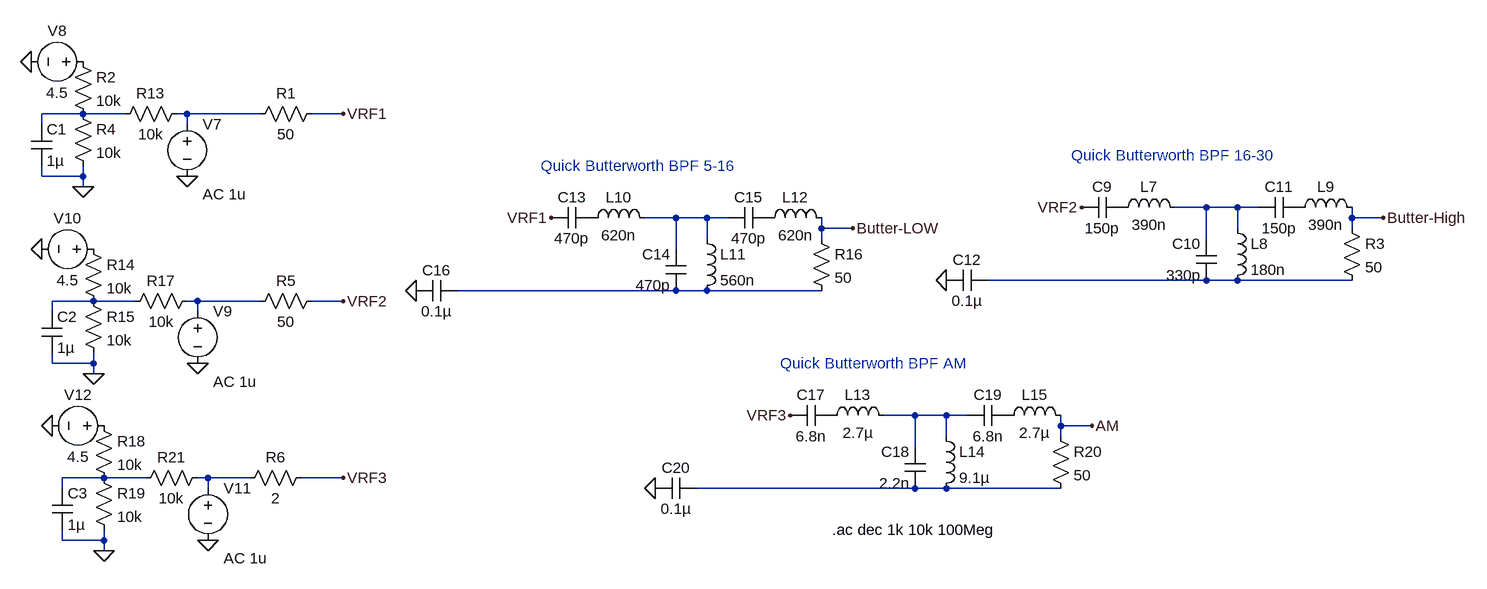
[diagram p0: schematic ensemble_BPF_Comparison.asc]
ensemble_BPF_Comparison.asc, the LTspice schematic file:
Version 4
SHEET 1 1788 1420
WIRE -368 256 -432 256
WIRE -304 256 -368 256
WIRE -208 256 -224 256
WIRE -96 256 -208 256
WIRE 32 256 -16 256
WIRE -432 272 -432 256
WIRE -208 272 -208 256
WIRE -432 352 -432 336
WIRE -368 352 -368 336
WIRE -368 352 -432 352
WIRE -368 368 -368 352
WIRE 1360 400 1312 400
WIRE 1408 400 1360 400
WIRE 1440 400 1408 400
WIRE 544 416 496 416
WIRE 592 416 544 416
WIRE 624 416 592 416
WIRE 1584 416 1584 400
WIRE 1632 416 1584 416
WIRE 768 432 768 416
WIRE 816 432 768 432
WIRE 1408 432 1408 400
WIRE 1584 432 1584 416
WIRE 592 448 592 416
WIRE 768 448 768 432
WIRE 1360 448 1360 400
WIRE 544 464 544 416
WIRE 1360 512 1024 512
WIRE 1408 512 1360 512
WIRE 1584 512 1408 512
WIRE 544 528 208 528
WIRE 592 528 544 528
WIRE 768 528 592 528
WIRE -352 544 -416 544
WIRE -288 544 -352 544
WIRE -192 544 -208 544
WIRE -96 544 -192 544
WIRE 32 544 -16 544
WIRE -416 560 -416 544
WIRE -192 560 -192 544
WIRE -416 640 -416 624
WIRE -352 640 -352 624
WIRE -352 640 -416 640
WIRE -352 656 -352 640
WIRE 912 720 864 720
WIRE 960 720 912 720
WIRE 992 720 960 720
WIRE 1136 736 1136 720
WIRE 1184 736 1136 736
WIRE 960 752 960 720
WIRE 1136 752 1136 736
WIRE 912 768 912 720
WIRE -336 816 -400 816
WIRE -272 816 -336 816
WIRE -176 816 -192 816
WIRE -112 816 -176 816
WIRE 32 816 -32 816
WIRE -400 832 -400 816
WIRE -176 832 -176 816
WIRE 912 832 576 832
WIRE 960 832 912 832
WIRE 1136 832 960 832
WIRE -400 912 -400 896
WIRE -336 912 -336 896
WIRE -336 912 -400 912
WIRE -336 928 -336 912
FLAG 32 256 VRF1
FLAG 960 512 0
FLAG 1632 416 Butter-High
FLAG 1168 400 VRF2
FLAG 144 528 0
FLAG 816 432 Butter-LOW
FLAG 352 416 VRF1
FLAG 512 832 0
FLAG 1184 736 AM
FLAG 720 720 VRF3
FLAG -208 352 0
FLAG -448 176 0
FLAG -368 368 0
FLAG 32 544 VRF2
FLAG -192 640 0
FLAG -432 464 0
FLAG -352 656 0
FLAG 32 816 VRF3
FLAG -176 912 0
FLAG -416 736 0
FLAG -336 928 0
SYMBOL res 1568 416 R0
SYMATTR InstName R3
SYMATTR Value 50
SYMBOL cap 1232 384 R90
WINDOW 0 0 32 VBottom 2
WINDOW 3 32 32 VTop 2
SYMATTR InstName C9
SYMATTR Value 150p
SYMBOL cap 1376 512 R180
WINDOW 0 24 56 Left 2
WINDOW 3 24 8 Left 2
SYMATTR InstName C10
SYMATTR Value 330p
SYMBOL cap 1440 416 R270
WINDOW 0 32 32 VTop 2
WINDOW 3 0 32 VBottom 2
SYMATTR InstName C11
SYMATTR Value 150p
SYMBOL ind 1216 416 R270
WINDOW 0 32 56 VTop 2
WINDOW 3 5 56 VBottom 2
SYMATTR InstName L7
SYMATTR Value 390n
SYMBOL ind 1392 416 R0
SYMATTR InstName L8
SYMATTR Value 180n
SYMBOL ind 1488 416 R270
WINDOW 0 32 56 VTop 2
WINDOW 3 5 56 VBottom 2
SYMATTR InstName L9
SYMATTR Value 390n
SYMBOL cap 1024 496 R90
WINDOW 0 0 32 VBottom 2
WINDOW 3 32 32 VTop 2
SYMATTR InstName C12
SYMATTR Value 0.1µ
SYMBOL res 752 432 R0
SYMATTR InstName R16
SYMATTR Value 50
SYMBOL cap 416 400 R90
WINDOW 0 0 32 VBottom 2
WINDOW 3 32 32 VTop 2
SYMATTR InstName C13
SYMATTR Value 470p
SYMBOL cap 560 528 R180
WINDOW 0 24 56 Left 2
WINDOW 3 24 8 Left 2
SYMATTR InstName C14
SYMATTR Value 470p
SYMBOL cap 624 432 R270
WINDOW 0 32 32 VTop 2
WINDOW 3 0 32 VBottom 2
SYMATTR InstName C15
SYMATTR Value 470p
SYMBOL ind 400 432 R270
WINDOW 0 32 56 VTop 2
WINDOW 3 5 56 VBottom 2
SYMATTR InstName L10
SYMATTR Value 620n
SYMBOL ind 576 432 R0
SYMATTR InstName L11
SYMATTR Value 560n
SYMBOL ind 672 432 R270
WINDOW 0 32 56 VTop 2
WINDOW 3 5 56 VBottom 2
SYMATTR InstName L12
SYMATTR Value 620n
SYMBOL cap 208 512 R90
WINDOW 0 0 32 VBottom 2
WINDOW 3 32 32 VTop 2
SYMATTR InstName C16
SYMATTR Value 0.1µ
SYMBOL res 1120 736 R0
SYMATTR InstName R20
SYMATTR Value 50
SYMBOL cap 784 704 R90
WINDOW 0 0 32 VBottom 2
WINDOW 3 32 32 VTop 2
SYMATTR InstName C17
SYMATTR Value 6.8n
SYMBOL cap 928 832 R180
WINDOW 0 24 56 Left 2
WINDOW 3 24 8 Left 2
SYMATTR InstName C18
SYMATTR Value 2.2n
SYMBOL cap 992 736 R270
WINDOW 0 32 32 VTop 2
WINDOW 3 0 32 VBottom 2
SYMATTR InstName C19
SYMATTR Value 6.8n
SYMBOL ind 768 736 R270
WINDOW 0 32 56 VTop 2
WINDOW 3 5 56 VBottom 2
SYMATTR InstName L13
SYMATTR Value 2.7µ
SYMBOL ind 944 736 R0
SYMATTR InstName L14
SYMATTR Value 9.1µ
SYMBOL ind 1040 736 R270
WINDOW 0 32 56 VTop 2
WINDOW 3 5 56 VBottom 2
SYMATTR InstName L15
SYMATTR Value 2.7µ
SYMBOL cap 576 816 R90
WINDOW 0 0 32 VBottom 2
WINDOW 3 32 32 VTop 2
SYMATTR InstName C20
SYMATTR Value 0.1µ
SYMBOL voltage -208 256 R0
WINDOW 123 24 124 Left 2
WINDOW 39 0 0 Left 0
SYMATTR Value2 AC 1u
SYMATTR InstName V7
SYMATTR Value ""
SYMBOL voltage -352 176 R90
WINDOW 0 -32 56 VBottom 2
WINDOW 3 32 56 VTop 2
WINDOW 123 0 0 Left 0
WINDOW 39 0 0 Left 0
SYMATTR InstName V8
SYMATTR Value 4.5
SYMBOL res -384 160 R0
SYMATTR InstName R2
SYMATTR Value 10k
SYMBOL res -384 240 R0
SYMATTR InstName R4
SYMATTR Value 10k
SYMBOL cap -448 272 R0
SYMATTR InstName C1
SYMATTR Value 1µ
SYMBOL res -208 240 R90
WINDOW 0 0 56 VBottom 2
WINDOW 3 32 56 VTop 2
SYMATTR InstName R13
SYMATTR Value 10k
SYMBOL voltage -192 544 R0
WINDOW 123 24 124 Left 2
WINDOW 39 0 0 Left 0
SYMATTR Value2 AC 1u
SYMATTR InstName V9
SYMATTR Value ""
SYMBOL voltage -336 464 R90
WINDOW 0 -32 56 VBottom 2
WINDOW 3 32 56 VTop 2
WINDOW 123 0 0 Left 0
WINDOW 39 0 0 Left 0
SYMATTR InstName V10
SYMATTR Value 4.5
SYMBOL res -368 448 R0
SYMATTR InstName R14
SYMATTR Value 10k
SYMBOL res -368 528 R0
SYMATTR InstName R15
SYMATTR Value 10k
SYMBOL cap -432 560 R0
SYMATTR InstName C2
SYMATTR Value 1µ
SYMBOL res -192 528 R90
WINDOW 0 0 56 VBottom 2
WINDOW 3 32 56 VTop 2
SYMATTR InstName R17
SYMATTR Value 10k
SYMBOL voltage -176 816 R0
WINDOW 123 24 124 Left 2
WINDOW 39 0 0 Left 0
SYMATTR Value2 AC 1u
SYMATTR InstName V11
SYMATTR Value ""
SYMBOL voltage -320 736 R90
WINDOW 0 -32 56 VBottom 2
WINDOW 3 32 56 VTop 2
WINDOW 123 0 0 Left 0
WINDOW 39 0 0 Left 0
SYMATTR InstName V12
SYMATTR Value 4.5
SYMBOL res -352 720 R0
SYMATTR InstName R18
SYMATTR Value 10k
SYMBOL res -352 800 R0
SYMATTR InstName R19
SYMATTR Value 10k
SYMBOL cap -416 832 R0
SYMATTR InstName C3
SYMATTR Value 1µ
SYMBOL res -176 800 R90
WINDOW 0 0 56 VBottom 2
WINDOW 3 32 56 VTop 2
SYMATTR InstName R21
SYMATTR Value 10k
SYMBOL res 0 240 R90
WINDOW 0 0 56 VBottom 2
WINDOW 3 32 56 VTop 2
SYMATTR InstName R1
SYMATTR Value 50
SYMBOL res 0 528 R90
WINDOW 0 0 56 VBottom 2
WINDOW 3 32 56 VTop 2
SYMATTR InstName R5
SYMATTR Value 50
SYMBOL res -16 800 R90
WINDOW 0 0 56 VBottom 2
WINDOW 3 32 56 VTop 2
SYMATTR InstName R6
SYMATTR Value 2
TEXT 1152 320 Left 2 ;Quick Butterworth BPF 16-30
TEXT 336 336 Left 2 ;Quick Butterworth BPF 5-16
TEXT 704 640 Left 2 ;Quick Butterworth BPF AM
TEXT 784 896 Left 2 !.ac dec 1k 10k 100Meg

The netlist it stands for:
* ensemble_BPF_Comparison.asc
R3 Butter-High N005 50
C9 P001 VRF2 150p
C10 N005 N003 330p
C11 N003 P002 150p
L7 P001 N003 390n
L8 N003 N005 180n
L9 P002 Butter-High 390n
C12 N005 0 0.1µ
R16 Butter-LOW N006 50
C13 P003 VRF1 470p
C14 N006 N004 470p
C15 N004 P004 470p
L10 P003 N004 620n
L11 N004 N006 560n
L12 P004 Butter-LOW 620n
C16 N006 0 0.1µ
R20 AM N012 50
C17 P005 VRF3 6.8n
C18 N012 N009 2.2n
C19 N009 P006 6.8n
L13 P005 N009 2.7µ
L14 N009 N012 9.1µ
L15 P006 AM 2.7µ
C20 N012 0 0.1µ
V7 N002 0 AC 1u
V8 P007 0 4.5
R2 P007 N001 10k
R4 N001 0 10k
C1 N001 0 1µ
R13 N002 N001 10k
V9 N008 0 AC 1u
V10 P008 0 4.5
R14 P008 N007 10k
R15 N007 0 10k
C2 N007 0 1µ
R17 N008 N007 10k
V11 N011 0 AC 1u
V12 P009 0 4.5
R18 P009 N010 10k
R19 N010 0 10k
C3 N010 0 1µ
R21 N011 N010 10k
R1 VRF1 N002 50
R5 VRF2 N008 50
R6 VRF3 N011 2
* Quick Butterworth BPF 16-30
* Quick Butterworth BPF 5-16
* Quick Butterworth BPF AM
.ac dec 1k 10k 100Meg
.backanno
.end